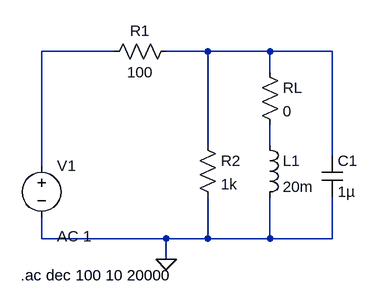
[diagram p0: schematic parallel_res_ltspice.asc]
parallel_res_ltspice.asc, the LTspice schematic file:
Version 4
SHEET 1 1028 680
WIRE 80 0 -32 0
WIRE 224 0 160 0
WIRE 320 0 224 0
WIRE 416 0 320 0
WIRE 320 32 320 0
WIRE 224 144 224 0
WIRE 320 144 320 112
WIRE 416 160 416 0
WIRE -32 176 -32 0
WIRE -32 288 -32 256
WIRE 160 288 -32 288
WIRE 224 288 224 224
WIRE 224 288 160 288
WIRE 320 288 320 224
WIRE 320 288 224 288
WIRE 416 288 416 224
WIRE 416 288 320 288
WIRE 160 320 160 288
FLAG 160 320 0
SYMBOL voltage -32 160 R0
WINDOW 123 24 124 Left 2
WINDOW 39 0 0 Left 0
SYMATTR Value2 AC 1
SYMATTR InstName V1
SYMATTR Value ""
SYMBOL res 176 -16 R90
WINDOW 0 0 56 VBottom 2
WINDOW 3 32 56 VTop 2
SYMATTR InstName R1
SYMATTR Value 100
SYMBOL res 208 128 R0
SYMATTR InstName R2
SYMATTR Value 1k
SYMBOL cap 400 160 R0
SYMATTR InstName C1
SYMATTR Value 1µ
SYMBOL ind 304 128 R0
SYMATTR InstName L1
SYMATTR Value 20m
SYMBOL res 304 16 R0
SYMATTR InstName RL
SYMATTR Value 0
TEXT -64 344 Left 2 !.ac dec 100 10 20000

The netlist it stands for:
* parallel_res_ltspice.asc
V1 N001 0 AC 1
R1 N002 N001 100
R2 N002 0 1k
C1 N002 0 1µ
L1 N003 0 20m
RL N002 N003 0
.ac dec 100 10 20000
.backanno
.end